# EAGLE design MCP794x-breakout (EAGLE 7.7.0)
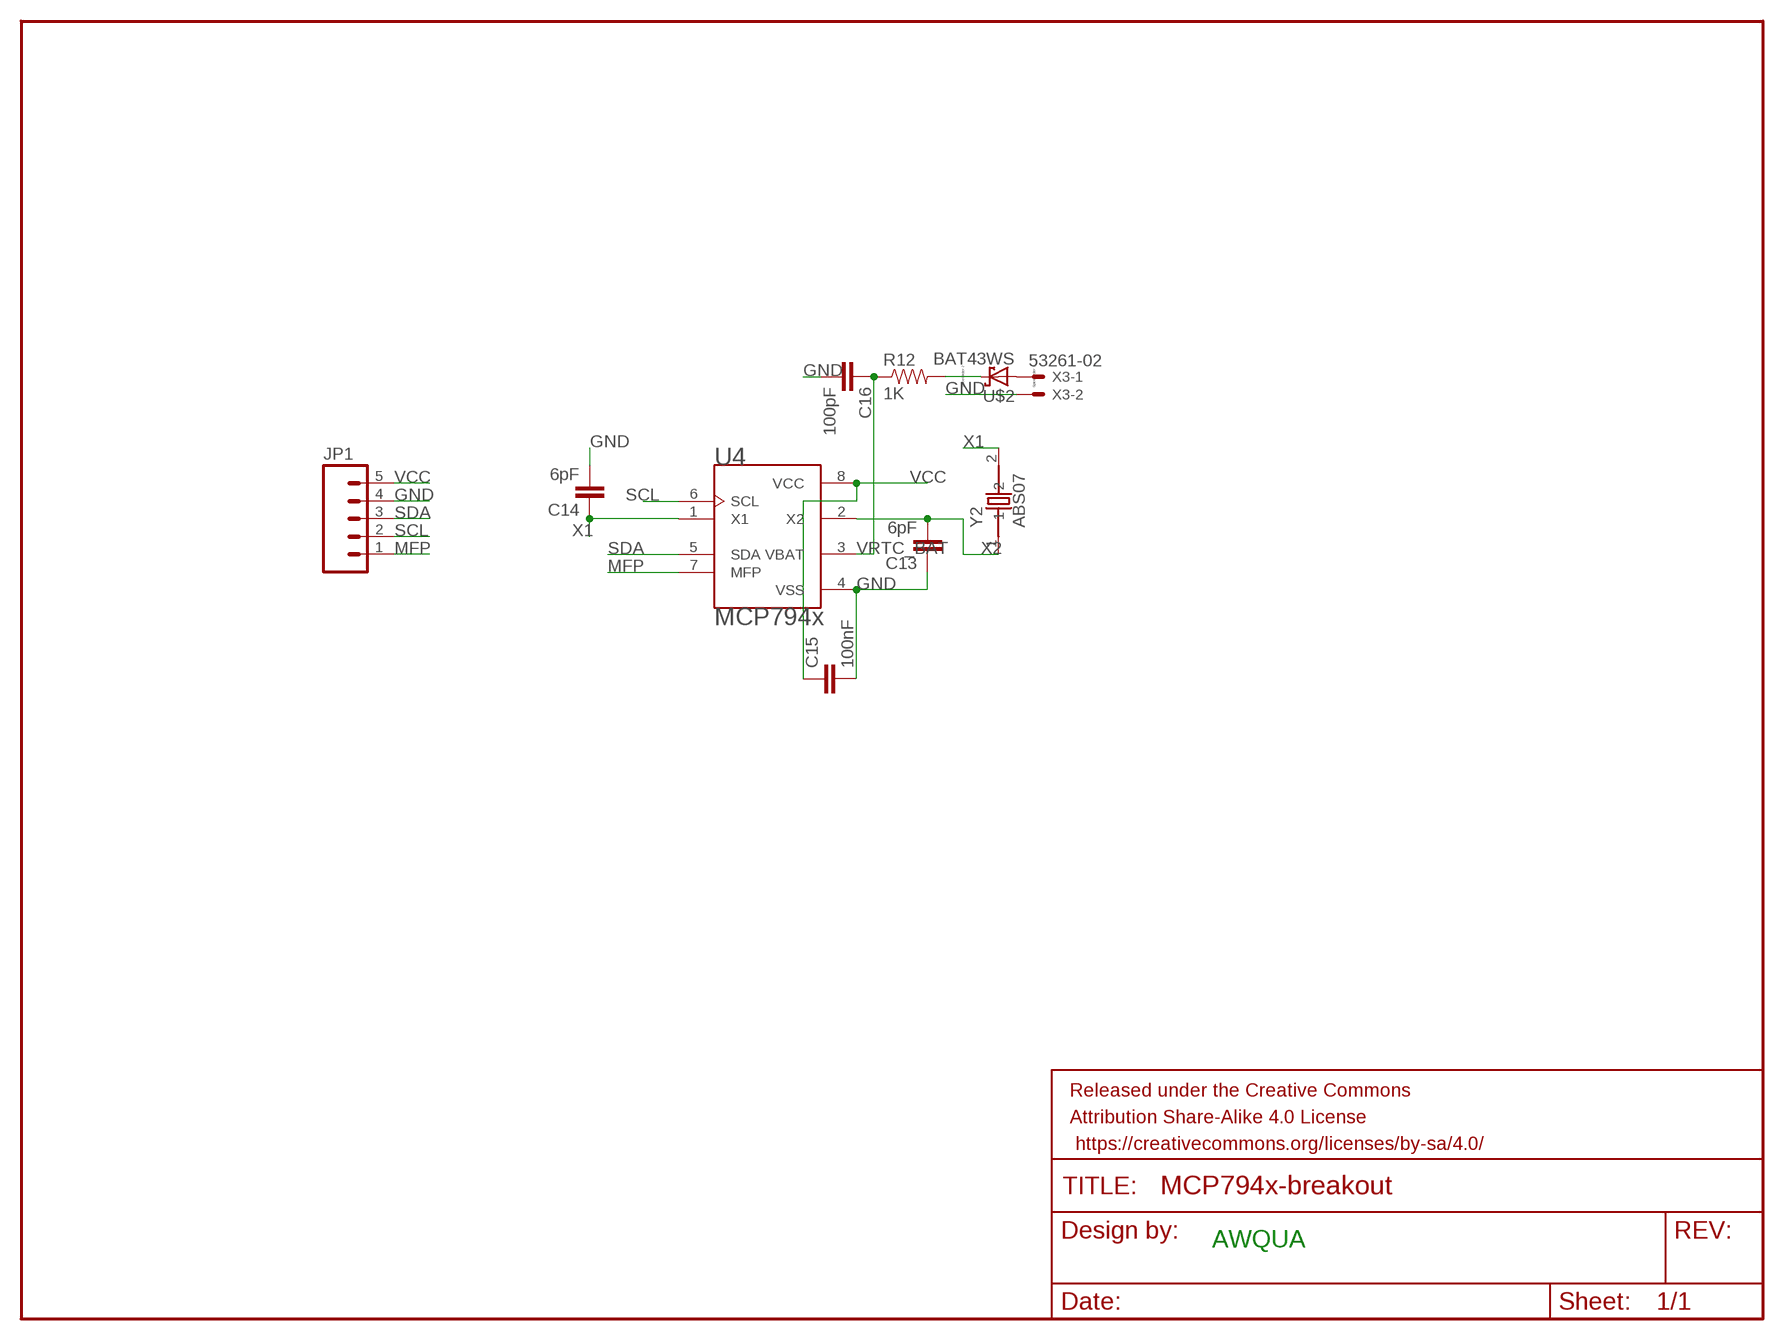
[diagram p0: schematic, sheet 1]

## Parts
C13  6pF  CAP0603-CAP  [0603-CAP]
C14  6pF  CAP0603-CAP  [0603-CAP]
C15  100nF  CAP0603-CAP  [0603-CAP]
C16  100pF  CAP0603-CAP  [0603-CAP]
FRAME1  FRAME-LETTER  [CREATIVE_COMMONS]
JP1  M05PTH  [1X05]
R12  1K  RESISTOR0603-RES  [0603-RES]
U4  MCP794x  MCP7940M-I/SN  [SOIC127P600X175-8N]
U$2  BAT43WS  [BAT43WS]
X3  53261-02  [53261-02]
Y2  ABS07  ABS07-32.768KHZ-T  [XTAL320X150X90]

## Nets
GND: C13.1 C14.2 C15.2 C16.2 JP1.4 U4.4(VSS) X3.2
MFP: JP1.1 U4.7(MFP)
N$2: U$2.PIN1(C) X3.1
N$4: R12.2 U$2.PIN2(A)
SCL: JP1.2 U4.6(SCL)
SDA: JP1.3 U4.5(SDA)
VCC: C15.1 JP1.5 U4.8(VCC)
VRTC_BAT: C16.1 R12.1 U4.3(VBAT)
X1: C14.1 U4.1(X1) Y2.2
X2: C13.2 U4.2(X2) Y2.1

## Notes on the sheet
- AWQUA

## Library data of the parts
C13-C16 = SparkFun-Passives:CAP: Capacitor Standard 0603 ceramic capacitor, and 0.1" leaded capacitor.
FRAME1 = SparkFun-Aesthetics:FRAME-LETTER: Schematic Frame Standard 8.5x11 US Letter frame
JP1 = SparkFun-Connectors:M05: Header 5 Standard 5-pin 0.1" header. Use with straight break away headers (SKU : PRT-00116), right angle break away headers (PRT-00553), swiss pins (PRT-00743), machine pins (PRT-00117), and female headers (PRT-00115). Molex polarized connector foot print use with SKU : PRT-08230 with associated crimp pins and housings.
R12 = SparkFun-Passives:RESISTOR: Resistor Basic schematic elements and footprints for 0603, 1206, and PTH resistors.
U4 = MCP7940M-I_SN:MCP7940M-I/SN: MCP7940M Series 5.5 V 64 byte I2C Real-Time Clock/Calendar with SRAM - SOIC-8; AVAILABILITY: Good; DESCRIPTION: MCP7940M Series 5.5 V 64 byte I2C Real-Time Clock/Calendar with SRAM - SOIC-8; MF: Microchip; MP: MCP7940M-I/SN; PACKAGE: SOIC-8 Microchip; PRICE: 0.62 USD
U$2 = BAT43WS:BAT43WS
X3 = con-molex:53?-02: CONNECTOR wire to board 1.25 mm (.049 inch) pitch header; OC_FARNELL: 1125373; OC_NEWARK: unknown
Y2 = ABS07-32.768KHZ-T:ABS07-32.768KHZ-T: ABS07 Series 32.768 kHz ±20 ppm 12.5 pF -40 to +85 °C SMT Low Profile Crystal; AVAILABILITY: Good; DESCRIPTION: ABS07 Series 32.768 kHz %C2%B120 ppm 12.5 pF -40 to %2B85 %C2%B0C SMT Low Profile Crystal; MF: Abracon; MP: ABS07-32.768KHZ-T; PACKAGE: 0805 Abracon; PRICE: 0.44 USD

## Board
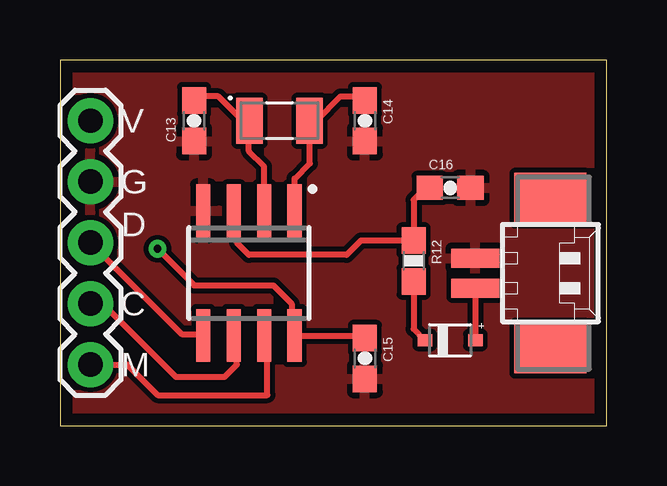
[diagram p1: board, top side]
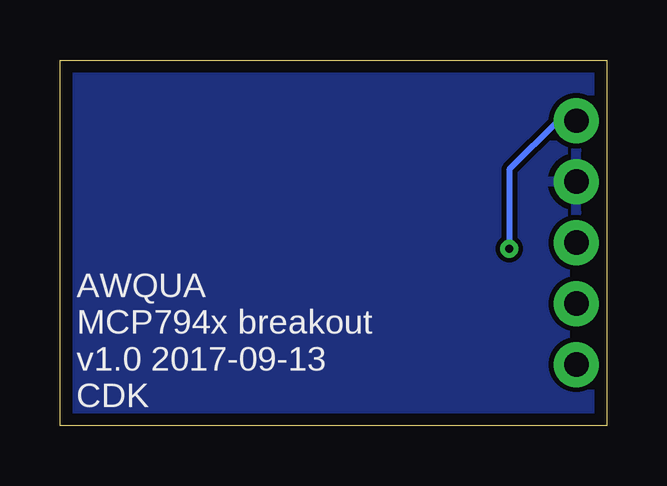
[diagram p2: board, bottom side, seen from below]

Size 22.78 x 15.23 mm. Coordinates in mm from the lower left corner, seen from the top.
Outline: 0,0 22.78,0 22.78,15.23 0,15.23 0,0
Copper layers (1*16): Top 0.035mm / dielectric 1.5mm / Bottom 0.035mm
Design rules "default *": minimum track width 10mil, minimum drill 12mil, track to track 8mil, track to pad 8mil, pad to pad 8mil, via to via 8mil, smd to smd 8mil, copper to edge 20mil, drill to drill 8mil, minimum pad ring 10mil, minimum via ring 8mil, stop-mask expansion 4mil, vias tented up to drill 12mil, thermal gap 10mil

### Footprints (pad centres in the part's own frame; a part is rotated, then mirrored left to right if it is on the bottom)
0603-CAP = smd 1.1 x 1: 1 -0.85,0; 2 0.85,0
1X05 = drill 1.016 pad 1.88: 1 0,0; 2 2.54,0; 3 5.08,0; 4 7.62,0; 5 10.16,0
0603-RES = smd 1.1 x 1: 1 -0.85,0; 2 0.85,0
SOIC127P600X175-8N = smd 2.2 x 0.6: 1 -2.6,1.905; 2 -2.6,0.635; 3 -2.6,-0.635; 4 -2.6,-1.905; 5 2.6,-1.905; 6 2.6,-0.635; 7 2.6,0.635; 8 2.6,1.905
BAT43WS = smd 0.6 x 0.5: PIN1 1.05,0; PIN2 -1.05,0
53261-02 = smd 0.8 x 2: 1 0.625,-2.5; 2 -0.625,-2.5 | smd 2.1 x 3: S1 3.125,0.625; S2 -3.125,0.625
XTAL320X150X90 = smd 1.1 x 1.9: 1 -1.25,0; 2 1.25,0

### Placement (x,y rotation side)
C13  5.59,12.7 90 top
C14  12.7,12.7 270 top
C15  12.7,2.79 270 top
C16  16.26,9.91 0 top
FRAME1  -4.32,-10.92 0 top  (outside the outline)
JP1  1.27,2.54 90 top
R12  14.73,6.86 270 top
U4  7.87,6.35 270 top
U$2  16.26,3.56 0 top
X3  19.81,6.35 270 top
Y2  9.14,12.7 0 top

### Tracks (layer width: path | path; a pad name or v marks a point on that pad's centre or on a via)
GND
  pour Bottom: -2.54,20.32 33.02,20.32 33.02,-3.81 -2.54,-3.81
  pour Top: -2.54,20.32 33.02,20.32 33.02,-3.81 -2.54,-3.81
MFP
  Top 0.254: U4.7 8.64,3.62 8.64,1.27 4.06,1.27 2.79,2.54 JP1.1
N$2
  Top 0.254: X3.1 U$2.PIN1
N$4
  Top 0.254: R12.2 14.73,4.03 U$2.PIN2
SCL
  Top 0.254: U4.6 7.37,3.62 7.37,2.54 6.86,2.03 4.83,2.03 1.78,5.08 JP1.2
SDA
  Top 0.254: JP1.3 5.08,3.81 5.91,3.81 U4.5
VCC  (via drill 0.33)
  Top 0.254: v4.06,7.37 5.59,5.84 8.89,5.84 9.65,5.08 9.65,3.88 U4.8 12.85,3.75 C15.1
  Bottom 0.254: v4.06,7.37 4.06,10.67 2.03,12.7 JP1.5
VRTC_BAT
  Top 0.254: C16.1 15.24,9.91 14.73,9.4 R12.1 12.53,7.71 11.94,7.11 7.87,7.11 7.37,7.62 7.37,8.82 U4.3
X1
  Top 0.254: U4.1 9.78,10.29 10.41,10.92 10.41,12.68 Y2.2 10.67,12.7 11.68,13.72 12.79,13.72 C14.1
X2
  Top 0.254: U4.2 8.51,10.79 7.87,11.43 7.87,12.68 Y2.1 7.62,12.7 6.6,13.72 5.5,13.72 C13.2

### Text on the board
tNames: V | G | D | C | M | AWQUA
bNames: AWQUA / MCP794x breakout / v1.0 2017-09-13 / CDK